# EAGLE design flex_probe (EAGLE 9.5.0)
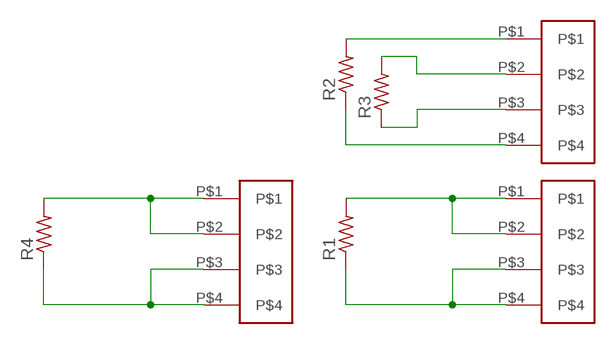
[diagram p0: schematic, sheet 1]

## Parts
R1  R-US_R0603  [R0603]
R2  R-US_R0603  [R0603]
R3  R-US_R0603  [R0603]
R4  R-US_R0603  [R0603]
U$1  CONN_1X4  [4PAD]
U$2  CONN_1X4  [4PAD]
U$3  CONN_1X4  [4PAD]

## Nets
N$1: R1.2 U$1.P$1 U$1.P$2
N$2: R1.1 U$1.P$3 U$1.P$4
N$6: R2.1 U$2.P$4
N$7: R3.2 U$2.P$2
N$8: R3.1 U$2.P$3
N$9: R2.2 U$2.P$1
N$10: R4.2 U$3.P$1 U$3.P$2
N$11: R4.1 U$3.P$3 U$3.P$4

## Library data of the parts
R1-R4 = resistor:R-US_: RESISTOR, American symbol
U$1-U$3 = marshal:CONN_1X4

## Board
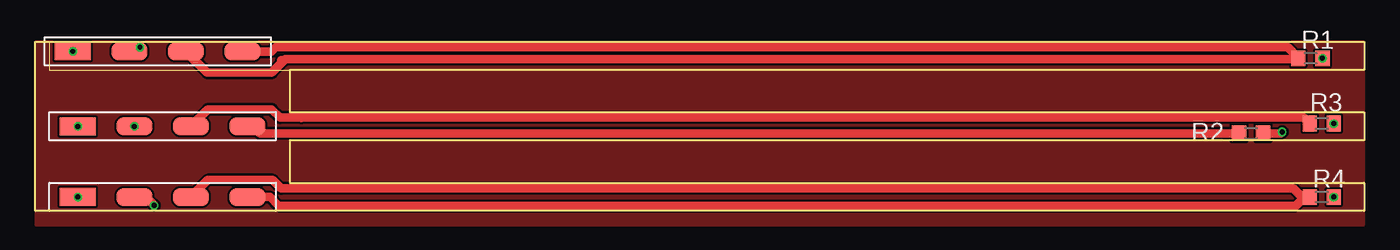
[diagram p1: board, top side]
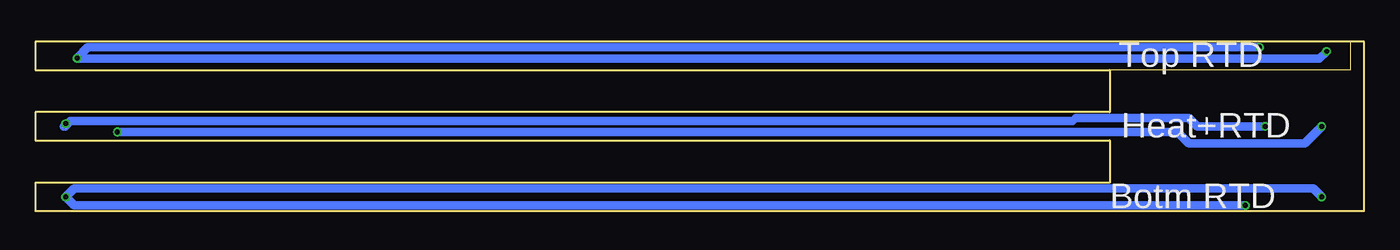
[diagram p2: board, bottom side, seen from below]

Size 94 x 12 mm. Coordinates in mm from the lower left corner, seen from the top.
Outline: 18,10 1,10 1,12 94,12
Outline: 94,12 0,12 0,0 94,0 94,2 18,2 18,5 94,5 94,7 18,7 18,10
Outline: 94,12 94,10 18,10
Copper layers (1*16): Top 0.035559375mm / dielectric 1.6mm / Bottom 0.035559375mm
Design rules "oshpark-2layer *": minimum track width 6mil, minimum drill 10mil, track to track 6mil, track to pad 6mil, pad to pad 6mil, via to via 6mil, smd to smd 6mil, copper to edge 0mil, drill to drill 6mil, minimum pad ring 5mil, minimum via ring 5mil, stop-mask expansion 2.5mil, vias tented up to drill 0mil, thermal gap 10mil

### Footprints (pad centres in the part's own frame; a part is rotated, then mirrored left to right if it is on the bottom)
R0603 = smd 1 x 1.1: 1 -0.85,0; 2 0.85,0
4PAD = smd 2.54 x 1.27: P$1 0,0; P$2 4,0; P$3 8,0; P$4 12,0

### Placement (x,y rotation side)
R1  90.2,10.83 0 top
R2  86,5.5 0 top
R3  91,6.2 0 top
R4  91,1 0 top
U$1  2.65,11.31 0 top
U$2  3,6 0 top
U$3  3,1 0 top

### Tracks (layer width: path | path; a pad name or v marks a point on that pad's centre or on a via)
N$1  (via drill 0.35)
  Top 0.61: U$1.P$2 6.94,11.6 v7.4,11.6
  Bottom 0.61: v7.4,11.6 90.28,11.6 R1.2 91.02,10.8 3.16,10.8 U$1.P$1
  other vias: 91.05,10.83 2.65,11.31
N$2
  Top 0.61: U$1.P$4 16.71,11.31 17,11.6 88.58,11.6 R1.1 89.28,10.76 17.68,10.76 17.61,10.69 | 17.61,10.69 17.4,10.69 | U$1.P$3 12.16,9.8 16.72,9.8 17.61,10.69
N$5
  pour Top: 0,12 0,-1 94,-1 94,12
N$6
  Top 0.61: R2.1 15.9,5.5 15.6,5.8 15.4,6 U$2.P$4
N$7  (via drill 0.35)
  Bottom 0.61: U$2.P$2 11.8,6 12.4,6.6 20.4,6.6 20.64,6.36 91.52,6.36 91.88,6 92,6 91.85,6.15 R3.2
  other vias: 7,6 91.85,6.2
N$8
  Top 0.61: U$2.P$3 12.2,7.2 16.72,7.2 17.3,6.62 18.82,6.62 | R3.1 89.73,6.62 18.82,6.62 | 18.82,6.62 18.8,6.6
N$9  (via drill 0.35)
  Top 0.61: R2.2 88.1,5.5 v88.2,5.6
  Bottom 0.61: v88.2,5.6 13.2,5.6 12.4,4.8 4.2,4.8 U$2.P$1
  other vias: 3,6
N$10  (via drill 0.35)
  Top 0.61: U$3.P$2 7.8,1 v8.4,0.4
  Bottom 0.61: v8.4,0.4 91.25,0.4 R4.2 91.25,1.6 3.6,1.6 U$3.P$1
  other vias: 91.85,1 3,1
N$11
  Top 0.61: U$3.P$4 16.6,1 17.22,0.38 89.18,0.38 89.8,1 R4.1 89.6,1 89,1.6 17.4,1.6 16.8,2.2 12.2,2.2 U$3.P$3

### Text on the board
bNames: Top RTD | Heat+RTD | Botm RTD